# EAGLE schematic untitled (EAGLE 9.1.3)
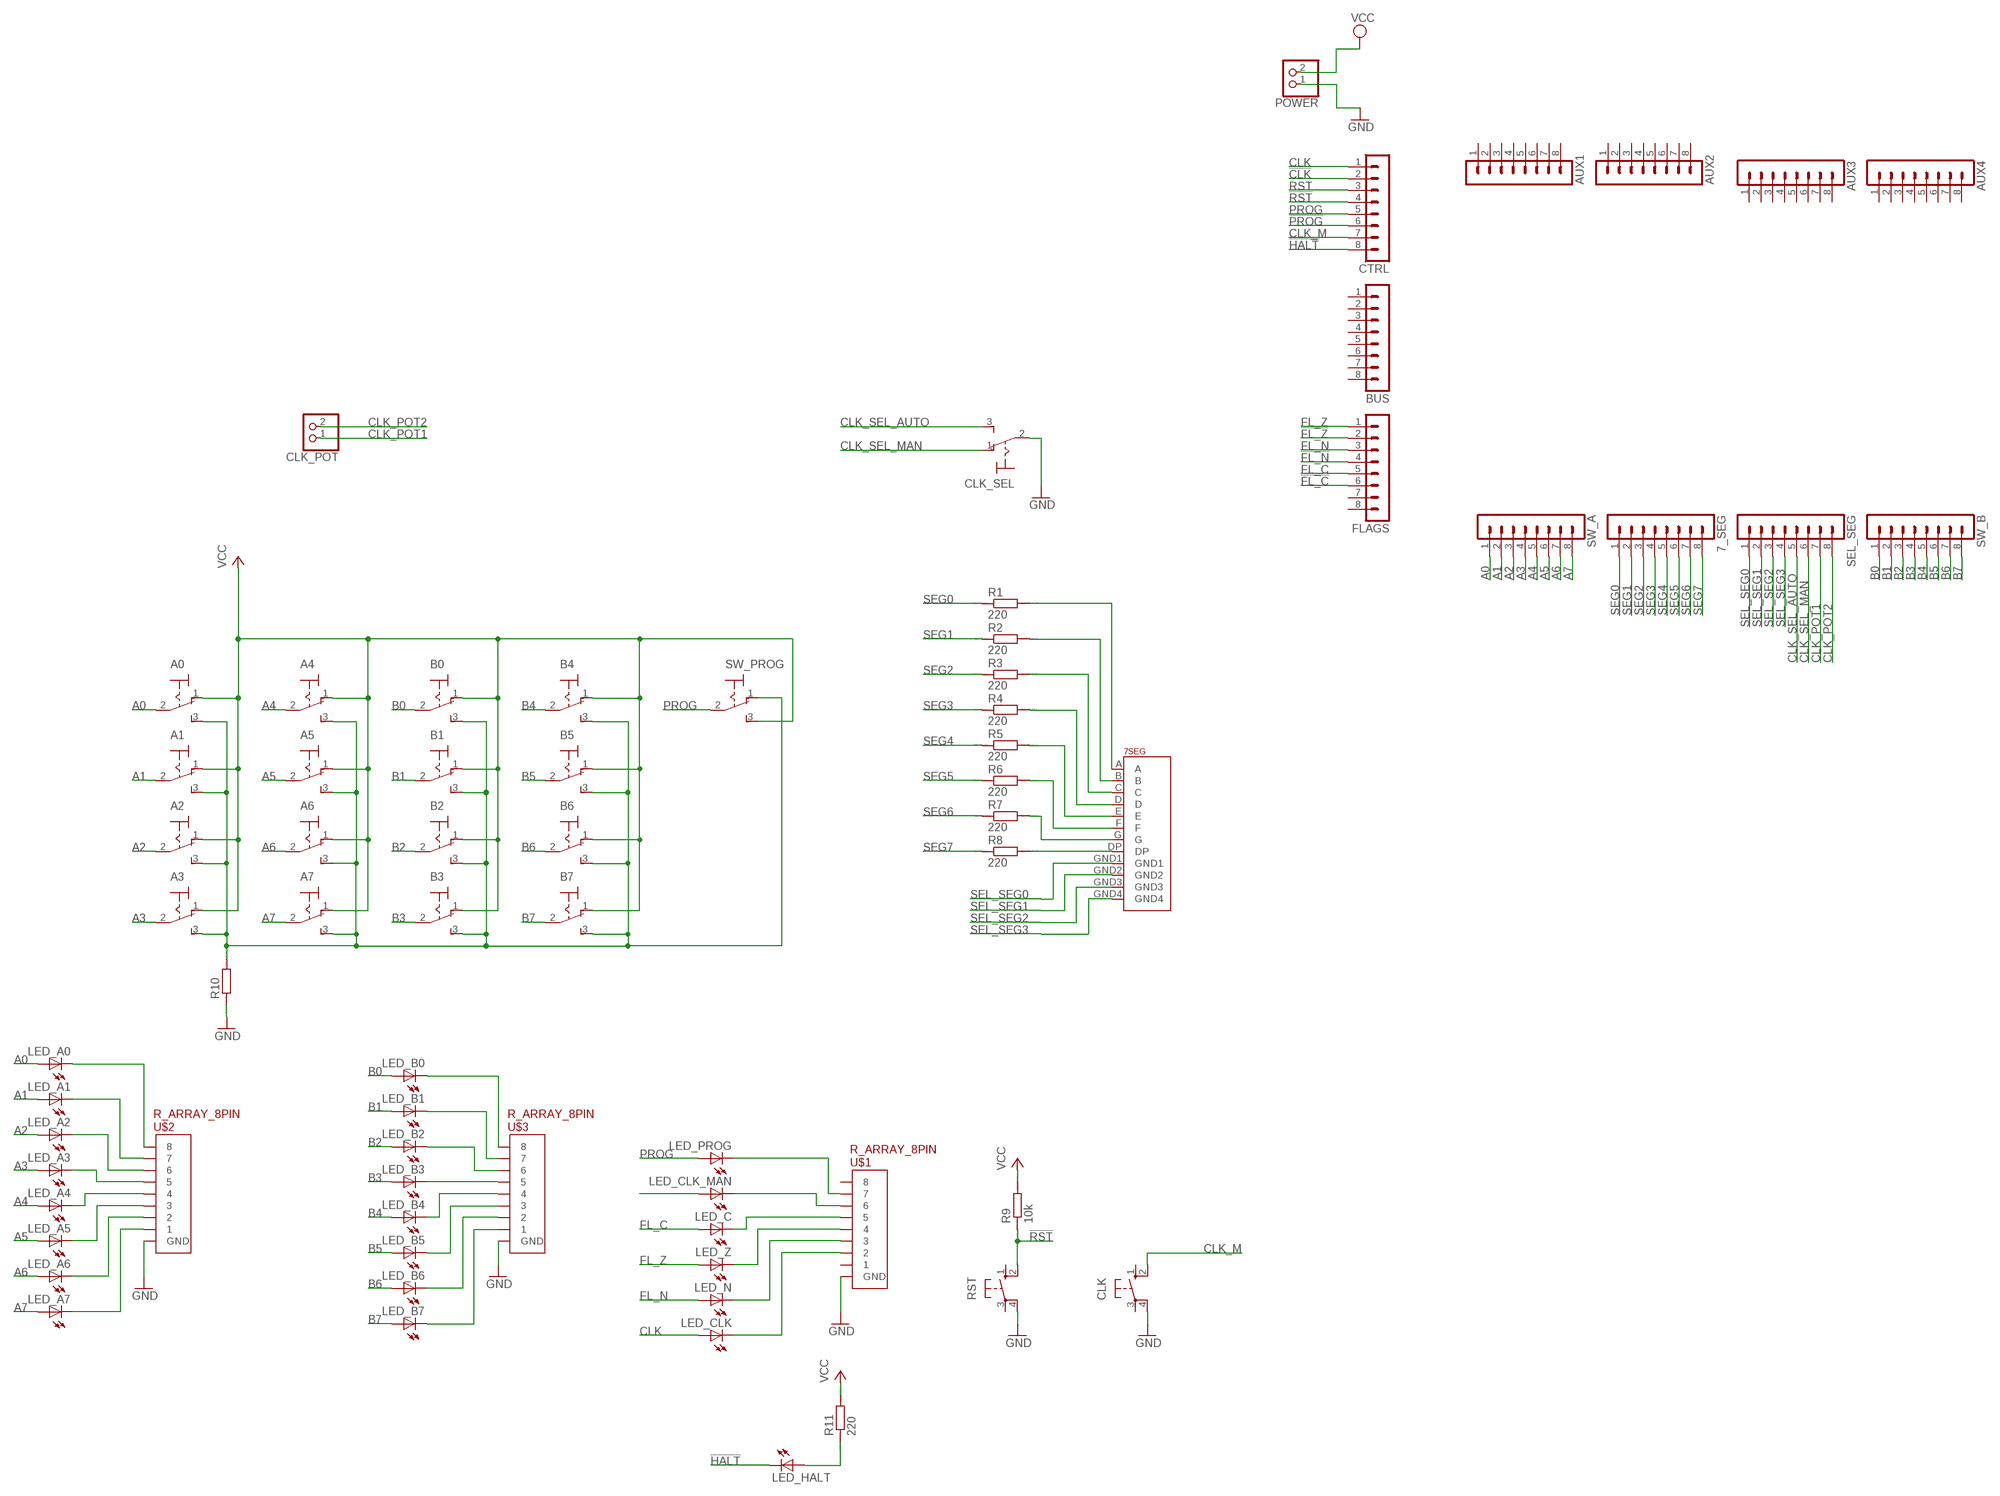
[diagram p0: schematic, sheet 1]

## Parts
7_SEG  MA08-1  [MA08-1]
7SEG  7SEGX4  [7SEGX4]
A0  M9040P  [M9040P]
A1  M9040P  [M9040P]
A2  M9040P  [M9040P]
A3  M9040P  [M9040P]
A4  M9040P  [M9040P]
A5  M9040P  [M9040P]
A6  M9040P  [M9040P]
A7  M9040P  [M9040P]
AUX1  MA08-1  [MA08-1]
AUX2  MA08-1  [MA08-1]
AUX3  MA08-1  [MA08-1]
AUX4  MA08-1  [MA08-1]
B0  M9040P  [M9040P]
B1  M9040P  [M9040P]
B2  M9040P  [M9040P]
B3  M9040P  [M9040P]
B4  M9040P  [M9040P]
B5  M9040P  [M9040P]
B6  M9040P  [M9040P]
B7  M9040P  [M9040P]
BUS  MA08-1  [MA08-1]
CLK  10-XX  [B3F-10XX]
CLK_POT  PINHD-1X2  [1X02]
CLK_SEL  M9040P  [M9040P]
CTRL  MA08-1  [MA08-1]
FLAGS  MA08-1  [MA08-1]
LED_A0  LED3MM  [LED3MM]
LED_A1  LED3MM  [LED3MM]
LED_A2  LED3MM  [LED3MM]
LED_A3  LED3MM  [LED3MM]
LED_A4  LED3MM  [LED3MM]
LED_A5  LED3MM  [LED3MM]
LED_A6  LED3MM  [LED3MM]
LED_A7  LED3MM  [LED3MM]
LED_B0  LED3MM  [LED3MM]
LED_B1  LED3MM  [LED3MM]
LED_B2  LED3MM  [LED3MM]
LED_B3  LED3MM  [LED3MM]
LED_B4  LED3MM  [LED3MM]
LED_B5  LED3MM  [LED3MM]
LED_B6  LED3MM  [LED3MM]
LED_B7  LED3MM  [LED3MM]
LED_C  LED3MM  [LED3MM]
LED_CLK  LED3MM  [LED3MM]
LED_CLK_MAN  LED3MM  [LED3MM]
LED_HALT  LED3MM  [LED3MM]
LED_N  LED3MM  [LED3MM]
LED_PROG  LED3MM  [LED3MM]
LED_Z  LED3MM  [LED3MM]
POWER  PINHD-1X2  [1X02]
R1  220  R0207/10  [0207/10]
R2  220  R0207/10  [0207/10]
R3  220  R0207/10  [0207/10]
R4  220  R0207/10  [0207/10]
R5  220  R0207/10  [0207/10]
R6  220  R0207/10  [0207/10]
R7  220  R0207/10  [0207/10]
R8  220  R0207/10  [0207/10]
R9  10k  R0207/10  [0207/10]
R10  R0207/10  [0207/10]
R11  220  R0207/10  [0207/10]
RST  10-XX  [B3F-10XX]
SEL_SEG  MA08-1  [MA08-1]
SW_A  MA08-1  [MA08-1]
SW_B  MA08-1  [MA08-1]
SW_PROG  M9040P  [M9040P]
U$1  R_ARRAY_8PIN  [R_ARRAY_8PIN]
U$2  R_ARRAY_8PIN  [R_ARRAY_8PIN]
U$3  R_ARRAY_8PIN  [R_ARRAY_8PIN]

## Nets
!CLK: CTRL.2
!FL_C: FLAGS.6
!FL_N: FLAGS.4
!FL_Z: FLAGS.2
!HALT: CTRL.8 LED_HALT.K(C)
!PROG: CTRL.6
!RST: CTRL.4 R9.1 RST.2(S1)
A0: A0.2(P) LED_A0.A SW_A.1
A1: A1.2(P) LED_A1.A SW_A.2
A2: A2.2(P) LED_A2.A SW_A.3
A3: A3.2(P) LED_A3.A SW_A.4
A4: A4.2(P) LED_A4.A SW_A.5
A5: A5.2(P) LED_A5.A SW_A.6
A6: A6.2(P) LED_A6.A SW_A.7
A7: A7.2(P) LED_A7.A SW_A.8
B0: B0.2(P) LED_B0.A SW_B.1
B1: B1.2(P) LED_B1.A SW_B.2
B2: B2.2(P) LED_B2.A SW_B.3
B3: B3.2(P) LED_B3.A SW_B.4
B4: B4.2(P) LED_B4.A SW_B.5
B5: B5.2(P) LED_B5.A SW_B.6
B6: B6.2(P) LED_B6.A SW_B.7
B7: B7.2(P) LED_B7.A SW_B.8
CLK: CTRL.1 LED_CLK.A
CLK_M: CLK.2(S1) CTRL.7
CLK_POT1: CLK_POT.1 SEL_SEG.7
CLK_POT2: CLK_POT.2 SEL_SEG.8
CLK_SEL_AUTO: CLK_SEL.3(S) SEL_SEG.5
CLK_SEL_MAN: CLK_SEL.1(O) SEL_SEG.6
FL_C: FLAGS.5 LED_C.A
FL_N: FLAGS.3 LED_N.A
FL_Z: FLAGS.1 LED_Z.A
GND: CLK.4(P1) CLK_SEL.2(P) POWER.1 R10.1 RST.4(P1) U$1.GND U$2.GND U$3.GND
N$1: LED_A0.K(C) U$2.8
N$2: A0.3(S) A1.3(S) A2.3(S) A3.3(S) A4.3(S) A5.3(S) A6.3(S) A7.3(S) B0.3(S) B1.3(S) B2.3(S) B3.3(S) B4.3(S) B5.3(S) B6.3(S) B7.3(S) R10.2 SW_PROG.1(O)
N$3: 7SEG.A R1.2
N$4: LED_HALT.A R11.1
N$5: 7SEG.B R2.2
N$6: 7SEG.C R3.2
N$7: 7SEG.D R4.2
N$8: 7SEG.E R5.2
N$9: 7SEG.F R6.2
N$10: 7SEG.G R7.2
N$17: 7SEG.DP R8.2
N$22: LED_A1.K(C) U$2.7
N$23: LED_A2.K(C) U$2.6
N$24: LED_A3.K(C) U$2.5
N$25: LED_A4.K(C) U$2.4
N$26: LED_A5.K(C) U$2.3
N$27: LED_A6.K(C) U$2.2
N$28: LED_A7.K(C) U$2.1
N$29: LED_B0.K(C) U$3.8
N$30: LED_B1.K(C) U$3.7
N$31: LED_B2.K(C) U$3.6
N$32: LED_B3.K(C) U$3.5
N$33: LED_B4.K(C) U$3.4
N$34: LED_B5.K(C) U$3.3
N$35: LED_B6.K(C) U$3.2
N$36: LED_B7.K(C) U$3.1
N$38: LED_PROG.K(C) U$1.7
N$40: LED_CLK_MAN.K(C) U$1.6
N$41: LED_CLK_MAN.A
N$42: LED_C.K(C) U$1.5
N$43: LED_Z.K(C) U$1.4
N$44: LED_N.K(C) U$1.3
N$45: LED_CLK.K(C) U$1.2
PROG: CTRL.5 LED_PROG.A SW_PROG.2(P)
RST: CTRL.3
SEG0: 7_SEG.1 R1.1
SEG1: 7_SEG.2 R2.1
SEG2: 7_SEG.3 R3.1
SEG3: 7_SEG.4 R4.1
SEG4: 7_SEG.5 R5.1
SEG5: 7_SEG.6 R6.1
SEG6: 7_SEG.7 R7.1
SEG7: 7_SEG.8 R8.1
SEL_SEG0: 7SEG.GND1 SEL_SEG.1
SEL_SEG1: 7SEG.GND2 SEL_SEG.2
SEL_SEG2: 7SEG.GND3 SEL_SEG.3
SEL_SEG3: 7SEG.GND4 SEL_SEG.4
VCC: A0.1(O) A1.1(O) A2.1(O) A3.1(O) A4.1(O) A5.1(O) A6.1(O) A7.1(O) B0.1(O) B1.1(O) B2.1(O) B3.1(O) B4.1(O) B5.1(O) B6.1(O) B7.1(O) POWER.2 R9.2 R11.2 SW_PROG.3(S)
Unconnected: AUX1.1 AUX1.2 AUX1.3 AUX1.4 AUX1.5 AUX1.6 AUX1.7 AUX1.8 AUX2.1 AUX2.2 AUX2.3 AUX2.4 AUX2.5 AUX2.6 AUX2.7 AUX2.8 AUX3.1 AUX3.2 AUX3.3 AUX3.4 AUX3.5 AUX3.6 AUX3.7 AUX3.8 AUX4.1 AUX4.2 AUX4.3 AUX4.4 AUX4.5 AUX4.6 AUX4.7 AUX4.8 BUS.1 BUS.2 BUS.3 BUS.4 BUS.5 BUS.6 BUS.7 BUS.8 CLK.1(S) CLK.3(P) FLAGS.7 FLAGS.8 RST.1(S) RST.3(P) U$1.1 U$1.8

## Library data of the parts
7_SEG AUX1-AUX4 BUS CTRL FLAGS SEL_SEG SW_A SW_B = con-lstb:MA08-1: PIN HEADER; OC_FARNELL: unknown; OC_NEWARK: unknown
7SEG = 8bit_components:7SEGX4
A0 A1-A7 B0 B1-B7 CLK_SEL SW_PROG = switch:M9040P: TOGGLE SWITCH Marquardt
CLK RST = switch-omron:10-XX: OMRON SWITCH; MPN: B3F-1000; OC_FARNELL: 176432; OC_NEWARK: 36M3542
CLK_POT POWER = pinhead:PINHD-1X2: PIN HEADER
LED_A0 LED_A1-LED_A7 LED_B0 LED_B1-LED_B7 LED_C LED_CLK LED_CLK_MAN LED_HALT LED_N LED_PROG LED_Z = led:LED: LED OSRAM: - CHIPLED LG R971, LG N971, LY N971, LG Q971, LY Q971, LO R971, LY R971 LH N974, LH R974 LS Q976, LO Q976, LY Q976 LO Q996 - Hyper CHIPLED LW Q18S LB Q993, LB Q99A, LB R99A - SideLED LS A670, LO A670, LY A670, LG A670, LP A670 LB A673, LV A673, LT A673, LW A673 LH A674 LY A675 LS A676, LA A676, LO A676, LY A676, LW A676 LS A679, LY A679, LG A679 - Hyper Micro SIDELED® LS Y876, LA Y876, LO Y876, LY Y876 LT Y87S - SmartLED LW L88C, LW L88S LB L89C, LB L89S, LG L890 LS L89K, LO L89K, LY L89K LS L896, LA L896, LO L896, LY L896 - TOPLED LS T670, LO T670, LY T670, LG T670, LP T670 LSG T670, LSP T670, LSY T670, LOP T670, LYG T670 LG T671, LOG T671, LSG T671 LB T673, LV T673, LT T673, LW T673 LH T674 LS T676, LA T676, LO T676, LY T676, LB T676, LH T676, LSB T676, LW T676 LB T67C, LV T67C, LT T67C, LS T67K, LO T67K, LY T67K, LW E67C LS E67B, LA E67B, LO E67B, LY E67B, LB E67C, LV E67C, LT E67C LW T67C LS T679, LY T679, LG T679 LS T770, LO T770, LY T770, LG T770, LP T770 LB T773, LV T773, LT T773, LW T773 LH T774 LS E675, LA E675, LY E675, LS T675 LS T776, LA T776, LO T776, LY T776, LB T776 LHGB T686 LT T68C, LB T68C - Hyper Mini TOPLED® LB M676 - Mini TOPLED Santana® LG M470 LS M47K, LO M47K, LY M47K Source: http://www.osram.convergy.de LUXEON: - LUMILED® LXK2-PW12-R00, LXK2-PW12-S00, LXK2-PW14-U00, LXK2-PW14-V00 LXK2-PM12-R00, LXK2-PM12-S00, LXK2-PM14-U00 LXK2-PE12-Q00, LXK2-PE12-R00, LXK2-PE12-S00, LXK2-PE14-T00, LXK2-PE14-U00 LXK2-PB12-K00, LXK2-PB12-L00, LXK2-PB12-M00, LXK2-PB14-N00, LXK2-PB14-P00, LXK2-PB14-Q00 LXK2-PR12-L00, LXK2-PR12-M00, LXK2-PR14-Q00, LXK2-PR14-R00 LXK2-PD12-Q00, LXK2-PD12-R00, LXK2-PD12-S00 LXK2-PH12-R00, LXK2-PH12-S00 LXK2-PL12-P00, LXK2-PL12-Q00, LXK2-PL12-R00 Source: www.luxeon.com KINGBRIGHT: KA-3528ASYC Source: www.kingbright.com
R1-R11 = eagle-ltspice:R: RESISTOR, European symbol; SPICEMODEL: NONE; SPICEPREFIX: R
U$1-U$3 = 8bit_components:R_ARRAY_8PIN